# Altium project piccolaPowerSupply.PrjPcb
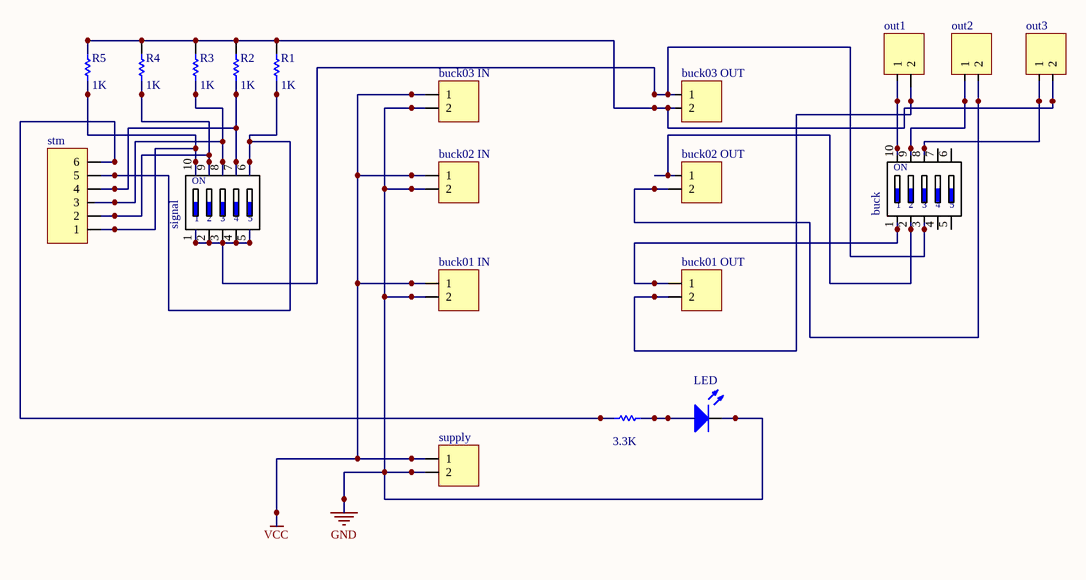
[diagram p0: piccolaPowerSupply.SchDoc]
1 sheet, 20 parts. Net scope: global (net labels, ports and power ports of the same name join across sheets).
Board file: piccolaPowerPCB.PcbDoc

## Sheet piccolaPowerSupply.SchDoc
size A

### Parts
buck  DS05  [*DS-05]  (value not drawn)
buck01_IN  Header 2  [HDR1X2]  (value not drawn)
buck01_OUT  Header 2  [HDR1X2]  (value not drawn)
buck02_IN  Header 2  [HDR1X2]  (value not drawn)
buck02_OUT  Header 2  [HDR1X2]  (value not drawn)
buck03_IN  Header 2  [HDR1X2]  (value not drawn)
buck03_OUT  Header 2  [HDR1X2]  (value not drawn)
LED  LED1  [LED-1]  (value not drawn)
out1  Header 2  [HDR1X2]  (value not drawn)
out2  Header 2  [HDR1X2]  (value not drawn)
out3  Header 2  [HDR1X2]  (value not drawn)
R0  3.3k  [AXIAL-0.3]
R1  value 1K  [AXIAL-0.3]  (hidden comment: Res1)
R2  value 1K  [AXIAL-0.3]  (hidden comment: Res1)
R3  value 1K  [AXIAL-0.3]  (hidden comment: Res1)
R4  value 1K  [AXIAL-0.3]  (hidden comment: Res1)
R5  value 1K  [AXIAL-0.3]  (hidden comment: 10K)
signal  DS05  [*DS-05]  (value not drawn)
stm  (no value)  [HDR1X6]
supply  Header 2  [HDR1X2]  (value not drawn)

### Nets
GND: buck01_IN.2 buck02_IN.2 buck03_IN.2 LED.2(K) supply.2
VCC: buck01_IN.1 buck02_IN.1 buck03_IN.1 supply.1
Netbuck01_OUT_2: buck01_OUT.2 out1.2
Netbuck02_OUT_2: buck02_OUT.2 out2.2
Netbuck03_OUT_2: buck03_OUT.2 out3.2 R1.2 R2.2 R3.2 R4.2 R5.2
Netbuck_1: buck.1 buck01_OUT.1
Netbuck_2: buck.2 buck02_OUT.1
Netbuck_3: buck.3 buck03_OUT.1 signal.1 signal.2 signal.3 signal.4 signal.5
Netbuck_8: buck.8 out3.1
Netbuck_9: buck.9 out2.1
Netbuck_10: buck.10 out1.1
NetLED_1: LED.1(A) R0.2
NetR0_1: R0.1 stm.6
NetR1_1: R1.1 signal.6 stm.5
NetR2_1: R2.1 signal.7 stm.4
NetR3_1: R3.1 signal.8 stm.3
NetR4_1: R4.1 signal.9 stm.2
NetR5_1: R5.1 signal.10 stm.1

Not connected (* = marked no-connect by the designer): buck 4 5 6 7

### Notes on the sheet
- (in symbol DS05) ON

### Library data of the parts
buck signal = DS05: Standard Dip Switch, Raised Actuator, 5 Position, Top Tape Sealed; MF: APEM Inc.; Availability: Unavailable; MP: DS05; Price: None; SnapEDA_Link: https://www.snapeda.com/parts/DS05/APEM%20Inc./view-part/?ref=snap; Package: None; Value: *
buck01_IN buck01_OUT buck02_IN buck02_OUT buck03_IN buck03_OUT out1-out3 supply = Header 2: Header, 2-Pin; LatestRevisionDate: 17-Jul-2002; LatestRevisionNote: Re-released for DXP Platform.; Publisher: Altium Limited
LED = LED1: Typical RED GaAs LED; Published: 8-Jun-2000; LatestRevisionDate: 08-Jul-2005; LatestRevisionNote: Mech Layer 1 removed.; PackageReference: LED-1; Publisher: Altium Limited; PackageDescription: LED; 2 Leads
R0-R5 = Res1: Resistor; Published: 8-Jun-2000; LatestRevisionDate: 17-Jul-2002; LatestRevisionNote: Re-released for DXP Platform.; PackageReference: AXIAL-0.3; Publisher: Altium Limited; PackageDescription: Axial Device, Thru-Hole; 2 Leads; 0.3 in Pin Spacing
  R?: Value: 3.3K
stm = Header 6: Header, 6-Pin; LatestRevisionDate: 17-Jul-2002; LatestRevisionNote: Re-released for DXP Platform.; Publisher: Altium Limited